# Altium schematic sheet Arduino Shield.SchDoc
size A4
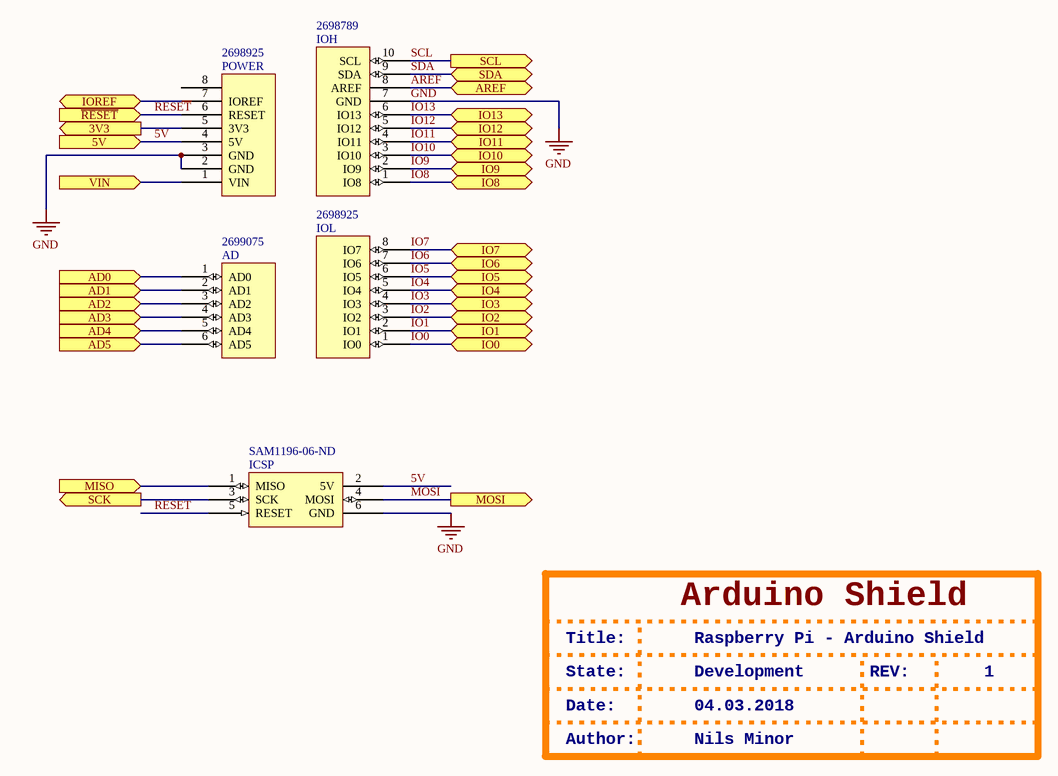
[diagram p0: Arduino Shield.SchDoc]

## Parts
AD  Supplier Part Number 4: 2699075  [Header 6x1 8.5mm]  (hidden comment: AD)
ICSP  Supplier Part Number 5: SAM1196-06-ND  [ICSP]  (hidden comment: ICSP)
IOH  Supplier Part Number 3: 2698789  [Header 10x1 8.5mm]  (hidden comment: IOH)
IOL  Supplier Part Number 4: 2698925  [Header 8x1 8.5mm]  (hidden comment: IOL)
POWER  Supplier Part Number 4: 2698925  [Header 8x1 8.5mm]  (hidden comment: POWER_UNO)

## Ports
3V3 (out), 5V (in), AD0 (in), AD1 (in), AD2 (in), AD3 (in), AD4 (in), AD5 (in), AREF (bidir), IO0 (bidir), IO1 (bidir), IO2 (bidir), IO3 (bidir), IO4 (bidir), IO5 (bidir), IO6 (bidir), IO7 (bidir), IO8 (bidir), IO9 (bidir), IO10 (bidir), IO11 (bidir), IO12 (bidir), IO13 (bidir), IOREF (bidir), MISO (in), MOSI (out), SCK (out), SCL (out), SDA (bidir), VIN (in), ~{RESET} (in)

## Nets
GND: ICSP.6(GND) IOH.7(GND) POWER.2(GND) POWER.3(GND)
3V3: POWER.5(3V3) ; port 3V3
5V: ICSP.2(5V) POWER.4(5V) ; port 5V
AD0: AD.1(AD0) ; port AD0
AD1: AD.2(AD1) ; port AD1
AD2: AD.3(AD2) ; port AD2
AD3: AD.4(AD3) ; port AD3
AD4: AD.5(AD4) ; port AD4
AD5: AD.6(AD5) ; port AD5
AREF: IOH.8(AREF) ; port AREF
IO0: IOL.1(IO0) ; port IO0
IO1: IOL.2(IO1) ; port IO1
IO2: IOL.3(IO2) ; port IO2
IO3: IOL.4(IO3) ; port IO3
IO4: IOL.5(IO4) ; port IO4
IO5: IOL.6(IO5) ; port IO5
IO6: IOL.7(IO6) ; port IO6
IO7: IOL.8(IO7) ; port IO7
IO8: IOH.1(IO8) ; port IO8
IO9: IOH.2(IO9) ; port IO9
IO10: IOH.3(IO10) ; port IO10
IO11: IOH.4(IO11) ; port IO11
IO12: IOH.5(IO12) ; port IO12
IO13: IOH.6(IO13) ; port IO13
IOREF: POWER.7(IOREF) ; port IOREF
MISO: ICSP.1(MISO) ; port MISO
MOSI: ICSP.4(MOSI) ; port MOSI
~{RESET}: ICSP.5(RESET) POWER.6(RESET) ; port ~{RESET}
SCK: ICSP.3(SCK) ; port SCK
SCL: IOH.10(SCL) ; port SCL
SDA: IOH.9(SDA) ; port SDA
VIN: POWER.1(VIN) ; port VIN

Not connected (* = marked no-connect by the designer): POWER 8

## Notes on the sheet
- Arduino Shield
- Title:
- State:
- Raspberry Pi - Arduino Shield
- Development
- REV:
- 1
- Date:
- Author:
- 04.03.2018
- Nils Minor

## Library data of the parts
AD = AD: Supplier 1: Arrow; Supplier Part Number 1: 2699089; Supplier 2: Digi-Key; Supplier Part Number 2: SAM1198-06-ND; Supplier 3: Arrow; Supplier Part Number 3: 2699088; Supplier 4: Arrow
ICSP = ICSP: Supplier 1: Arrow; Supplier Part Number 1: 2699117; Supplier 2: Arrow; Supplier Part Number 2: 2699116; Supplier 3: Digi-Key; Supplier Part Number 3: SAM1185-06-ND; Supplier 4: Arrow; Supplier Part Number 4: 2699091; Supplier 5: Digi-Key
IOH = IOH: Supplier 1: Arrow; Supplier Part Number 1: 2698803S4475693N1004; Supplier 2: Digi-Key; Supplier Part Number 2: SAM1198-10-ND; Supplier 3: Arrow
IOL = IOL: Supplier 1: Digi-Key; Supplier Part Number 1: SAM1198-08-ND; Supplier 2: Arrow; Supplier Part Number 2: 2698939; Supplier 3: Arrow; Supplier Part Number 3: 2698940; Supplier 4: Arrow
POWER = POWER_UNO: Supplier 1: Digi-Key; Supplier Part Number 1: SAM1198-08-ND; Supplier 2: Arrow; Supplier Part Number 2: 2698939; Supplier 3: Arrow; Supplier Part Number 3: 2698940; Supplier 4: Arrow